# Altium schematic sheet MS5611.SchDoc
size A4
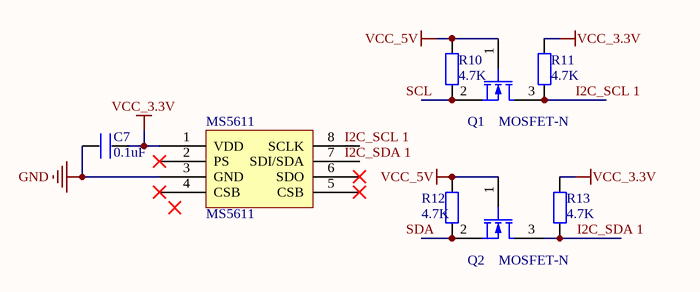
[diagram p0: MS5611.SchDoc]

## Parts
C7  0.1uF  [0805]
MS5611  MS5611  [MS5611]
Q1  MOSFET-N  [SOT-343_N]
Q2  MOSFET-N  [SOT-343_N]
R10  value 4.7K  [0805]  (hidden comment: Res2)
R11  value 4.7K  [0805]  (hidden comment: Res2)
R12  value 4.7K  [0805]  (hidden comment: Res2)
R13  value 4.7K  [0805]  (hidden comment: Res2)

## Nets
GND: C7.2 MS5611.3(GND)
VCC_3.3V: C7.1 MS5611.1(VDD) R11.2 R13.2
VCC_5V: Q1.1(G) Q2.1(G) R10.2 R12.2
I2C_SCL 1: Q1.3(D) R11.1
I2C_SDA 1: Q2.3(D) R13.1
NetQ1_2: Q1.2(S) R10.1
NetQ2_2: Q2.2(S) R12.1

Not connected (* = marked no-connect by the designer): MS5611 2(PS)* 4(CSB)* 5(CSB)* 6(SDO)* 7(SDI/SDA) 8(SCLK)

## Notes on the sheet
- Labels drawn without touching a wire or pin: SCL, SDA

## Library data of the parts
C7 = C
Q1 Q2 = MOSFET-N1: MOSFET; Published: 8-Jun-2000; LatestRevisionDate: 17-Jul-2002; LatestRevisionNote: Re-released for DXP Platform.; PackageVersion: 1995/1996; PackageReference: E3; Publisher: Altium Limited
R10-R13 = Res2: Resistor; Published: 8-Jun-2000; LatestRevisionDate: 17-Jul-2002; LatestRevisionNote: Re-released for DXP Platform.; PackageReference: AXIAL-0.4; Publisher: Altium Limited; PackageDescription: Axial Device, Thru-Hole; 2 Leads; 0.4 in Pin Spacing